# Altium schematic sheet projet_pcb_F103.SchDoc
size A3
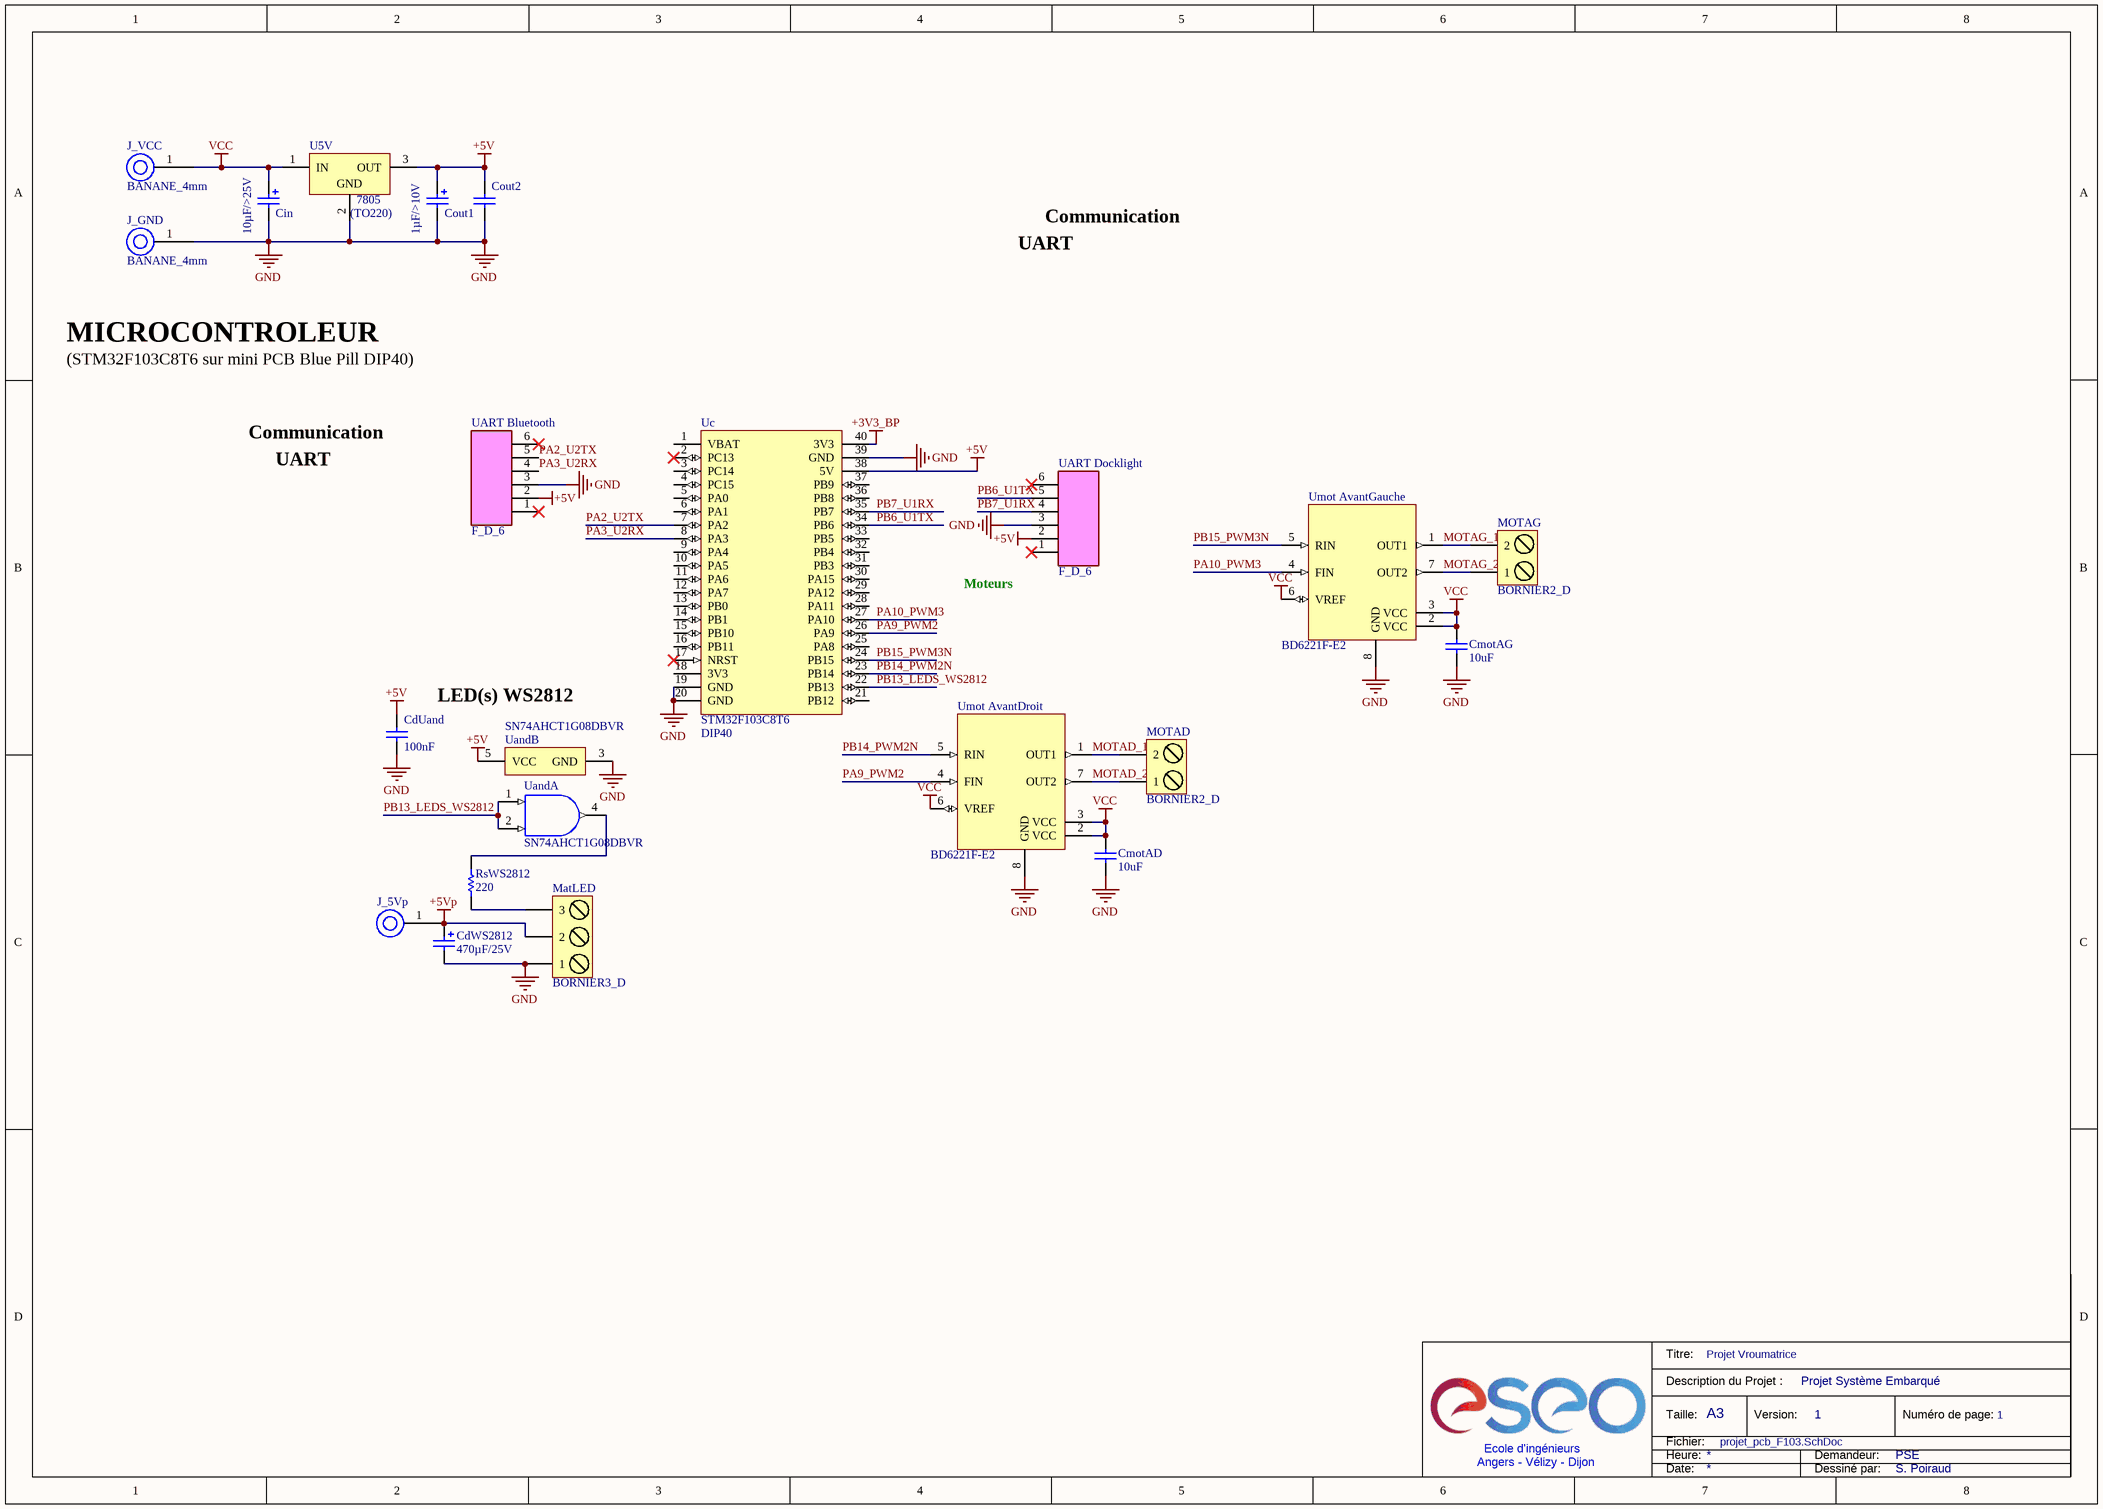
[diagram p0: projet_pcb_F103.SchDoc]

## Parts
CdUand  value 100nF  [CONDENSATEUR_CERAMIQUE_RADIAL_5.08]  (hidden comment: CONDENSATEUR_CER_RAD_5.08)
CdWS2812  value 470µF/25V  [CONDENSATEUR_POLARISE_ELECTROLYTIQUE_RADIAL_5.08/10.16]  (hidden comment: CONDENSATEUR_POL_ELECTROLY_RAD_5.08/10.16)
Cin  value 10µF/>25V  [CONDENSATEUR_POLARISE_ELECTROLYTIQUE_RADIAL_2.0/5.08]  (hidden comment: CONDENSATEUR_POL_ELECTROLY_RAD_2.0/5.08)
CmotAD  10uF  [CONDENSATEUR_POLARISE_ELECTROLYTIQUE_RADIAL_2.0/5.08]
CmotAG  10uF  [CONDENSATEUR_POLARISE_ELECTROLYTIQUE_RADIAL_2.0/5.08]
Cout1  value 1µF/>10V  [CONDENSATEUR_POLARISE_ELECTROLYTIQUE_RADIAL_2.0/5.08]  (hidden comment: CONDENSATEUR_POL_ELECTROLY_RAD_2.0/5.08)
Cout2  CONDENSATEUR_CER_RAD_5.08  [CONDENSATEUR_CERAMIQUE_RADIAL_5.08]  (value not drawn)
J_5Vp  DOUILLE BANANE 4mm  [DOUILLE_BANANE_4mm]  (value not drawn)
J_GND  Type: BANANE_4mm  [DOUILLE_BANANE_4mm]  (hidden comment: DOUILLE BANANE 4mm)
J_VCC  Type: BANANE_4mm  [DOUILLE_BANANE_4mm]  (hidden comment: DOUILLE BANANE 4mm)
MatLED  Type: BORNIER3_D  [BORNIER3_A_VIS]  (hidden comment: BORNIER3 DROIT A VIS)
MOTAD  Type: BORNIER2_D  [BORNIER2_A_VIS]  (hidden comment: BORNIER2 DROIT A VIS)
MOTAG  Type: BORNIER2_D  [BORNIER2_A_VIS]  (hidden comment: BORNIER2 DROIT A VIS)
RsWS2812  220  [RESISTANCE_1/4W]
U5V  Type: 7805  Package: (TO220)  [REGULATEUR_TO220_78XX]  (hidden comment: REGULATEUR_TO220_78XX)
Uand  SN74AHCT1G08DBVR  [DBV0005A_N]  (parts A,B of 2)
UART_Bluetooth  Type: F_D_6  [BARRETTE_6_F_D]  (hidden comment: BARRETTE_6 CONTACTS_1 RANGEE_FEMELLE_DROITE)
UART_Docklight  Type: F_D_6  [BARRETTE_6_F_D]  (hidden comment: BARRETTE_6 CONTACTS_1 RANGEE_FEMELLE_DROITE)
Uc  Type: STM32F103C8T6  Package: DIP40  [STM32F103C8T6_DIP40]  (hidden comment: STM32F103C8T6/PCB_DIP40)
Umot_AvantDroit  BD6221F-E2  [SOIC8_PAS=1.27_LARG=4_LONG=5]
Umot_AvantGauche  BD6221F-E2  [SOIC8_PAS=1.27_LARG=4_LONG=5]

## Nets
+3V3_BP: Uc.40(3V3)
+5V: CdUand.2 Cout1.1 Cout2.2 U5V.3(OUT) Uand.5(VCC) UART_Bluetooth.2 UART_Docklight.2 Uc.38(5V)
+5Vp: CdWS2812.1 J_5Vp.1 MatLED.2
GND: CdUand.1 CdWS2812.2 Cin.2 CmotAD.1 CmotAG.1 Cout1.2 Cout2.1 J_GND.1 MatLED.1 U5V.2(GND) Uand.3(GND) UART_Bluetooth.3 UART_Docklight.3 Uc.19(GND) Uc.20(GND) Uc.39(GND) Umot_AvantDroit.8(GND) Umot_AvantGauche.8(GND)
VCC: Cin.1 CmotAD.2 CmotAG.2 J_VCC.1 U5V.1(IN) Umot_AvantDroit.2(VCC) Umot_AvantDroit.3(VCC) Umot_AvantDroit.6(VREF) Umot_AvantGauche.2(VCC) Umot_AvantGauche.3(VCC) Umot_AvantGauche.6(VREF)
MOTAD_1: MOTAD.2 Umot_AvantDroit.1(OUT1)
MOTAD_2: MOTAD.1 Umot_AvantDroit.7(OUT2)
MOTAG_1: MOTAG.2 Umot_AvantGauche.1(OUT1)
MOTAG_2: MOTAG.1 Umot_AvantGauche.7(OUT2)
PA2_U2TX: UART_Bluetooth.5 Uc.7(PA2)
PA3_U2RX: UART_Bluetooth.4 Uc.8(PA3)
PA9_PWM2: Uc.26(PA9) Umot_AvantDroit.4(FIN)
PA10_PWM3: Uc.27(PA10) Umot_AvantGauche.4(FIN)
PB6_U1TX: UART_Docklight.5 Uc.34(PB6)
PB7_U1RX: UART_Docklight.4 Uc.35(PB7)
PB13_LEDS_WS2812: Uand.1(A) Uand.2(B) Uc.22(PB13)
PB14_PWM2N: Uc.23(PB14) Umot_AvantDroit.5(RIN)
PB15_PWM3N: Uc.24(PB15) Umot_AvantGauche.5(RIN)
NetMatLED_3: MatLED.3 RsWS2812.1
NetRsWS2812_2: RsWS2812.2 Uand.4(Y)

Not connected (* = marked no-connect by the designer): UART_Bluetooth 1* 6*; UART_Docklight 1* 6*; Uc 1(VBAT) 2(PC13)* 3(PC14) 4(PC15) 5(PA0) 6(PA1) 9(PA4) 10(PA5) 11(PA6) 12(PA7) 13(PB0) 14(PB1) 15(PB10) 16(PB11) 17(NRST)* 18(3V3) 21(PB12) 25(PA8) 28(PA11) 29(PA12) 30(PA15) 31(PB3) 32(PB4) 33(PB5) 36(PB8) 37(PB9)

## Notes on the sheet
- Communication
- UART
- MICROCONTROLEUR
- (STM32F103C8T6 sur mini PCB Blue Pill DIP40)
- Moteurs
- LED(s) WS2812
- Titre:
- Description du Projet :
- Projet Vroumatrice
- Projet Système Embarqué
- Ecole d'ingénieurs
- Taille:
- Heure:
- Fichier:
- A3
- Version:
- 1
- Demandeur:
- PSE
- Numéro de page:
- Angers - Vélizy - Dijon
- Date:
- Dessiné par:
- S. Poiraud

## Library data of the parts
CdUand Cout2 = CONDENSATEUR_CER_RAD_5.08: CONDENSATEUR TRAVERSANT CERAMIQUE RADIAL 5.08mm
  CdUand: Type: RADIAL_5.08
CdWS2812 = CONDENSATEUR_POL_ELECTROLY_RAD_5.08/10.16: CONDENSATEUR POLARISE ELECTROLYTIQUE RADIAL 5.08/10.16; Type: POL_RAD_5.08/10.16
Cin Cout1 = CONDENSATEUR_POL_ELECTROLY_RAD_2.0/5.08: CONDENSATEUR POLARISE ELECTROLYTIQUE RADIAL 2.0/5.08; Type: POL_RAD_2.0/5.08
CmotAD CmotAG = Condensateur: Capacitor; Published: 8-Jun-2000; LatestRevisionDate: 17-Jul-2002; LatestRevisionNote: Re-released for DXP Platform.; PackageReference: RAD-0.3; Publisher: Altium Limited
J_5Vp J_GND J_VCC = DOUILLE_BANANE_4mm: DOUILLE BANANE 4 mm
  J_5Vp: Type: BANANE_4mm
MatLED = BORNIER3_DROIT_A VIS: BORNIER 3 PLOTS DROIT A VIS 5.08mm
MOTAD MOTAG = BORNIER2_DROIT_A VIS: BORNIER 2 PLOTS DROIT A VIS 5.08mm
RsWS2812 = Resistor: Published: 8-Jun-2000; LatestRevisionDate: 17-Jul-2002; LatestRevisionNote: Re-released for DXP Platform.; PackageReference: AXIAL-0.5; Publisher: Altium Limited
U5V = REGULATEUR_TO220_78XX: REGULATEUR DE TENSION POSITIVE 78XX BOITIER TO220
Uand = SN74AHCT1G08DBVR: Single 2-Input Positive-AND Gate, DBV0005A, LARGE T&R; Manufacturer: Texas Instruments; VCC(Min)(V): 2; VCC(Max)(V): 5.5; Output Type: CMOS; ICC @ Nom Voltage(Max)(mA): 0.01; Bits(#): 1; F @ Nom Voltage(Max)(Mhz): 75; Rating: Catalog; Technology Family: AHCT; Voltage(Nom)(V): 5; Schmitt Trigger: No; Output Drive (IOL/IOH)(Max)(mA): 8/-8; tpd @ Nom Voltage(Max)(ns): 7.1; Logic: True; Gate Type: AND; DatasheetVersion: SCLS315P; PackageReference: DBV0005A; Supplier 1: Mouser; Supplier Part Number 1: 595-SN74AHCT1G08DBVR; Supplier 2: Digi-Key; Supplier Part Number 2: 296-1113-2-ND; Supplier 3: Digi-Key; Supplier Part Number 3: 296-1113-1-ND; Supplier 4: Digi-Key; Supplier Part Number 4: 296-1113-6-ND; Generic Part Number: SN74AHCT1G08; Input Type: CMOS; Operating Temperature Range(C): -40 to 125; Sub-Family: AND Gate; 3-State Output: No; PartNumber: SN74AHCT1G08DBVR; ComponentLink1Description: Manufacturer URL; ComponentLink1URL: http://www.ti.com/; ComponentLink2Description: Datasheet; ComponentLink2URL: http://www.ti.com/lit/ds/symlink/sn74ahct1g08.pdf
UART_Bluetooth UART_Docklight = BARRETTE_6 CONTACTS_1 RANGEE_FEMELLE_DROITE: BARRETTE 6 CONTACTS 1 RANGEE FEMELLE DROITE
Uc = STM32F103C8T6/PCB_DIP40: MICROCONTROLEUR 32 BITS - 72MHz - 34 I/O - 64 KO : FLASH - 20KO RAM - 10 CANAUX A/D 12 BITS - DIP40 - UART, SPI, I2C, USB, CAN
Umot_AvantDroit Umot_AvantGauche = BD6220F: H Bridge - 2A